# Altium schematic sheet AnalogIN.SchDoc
size A
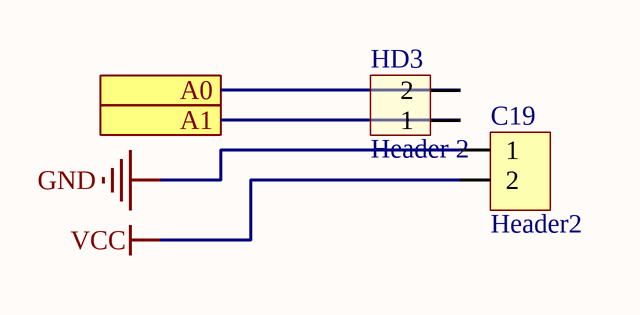
[diagram p0: AnalogIN.SchDoc]

## Parts
C19  Header2  [HDR2]
HD3  Header 2  [HED2T]

## Ports
A0, A1

## Nets
GND: C19.1
VCC: C19.2
A0: HD3.2 ; port A0
A1: HD3.1 ; port A1

## Library data of the parts
C19 = Header2: Header IDC, 2 x 1 Pin Vertical 2.54mm Pitch (Non-Boxed, Male); Manufacturer: W¨¹rth Elektronik eiSos GmbH; partNo: 613002143121; ComponentLink1 Description: Manufacturer; ComponentLink2 Description: Datasheet; NoPins: 02; Created Date: 29 March 2013; ComponentLink1URL: http://www.we-online.com; ComponentLink2URL: http://katalog.we-online.de/em/datasheet/6130xx143121.pdf; Created by: Karrer Zheng
HD3 = Hed2: Header 2 (Green); Value: Header 2